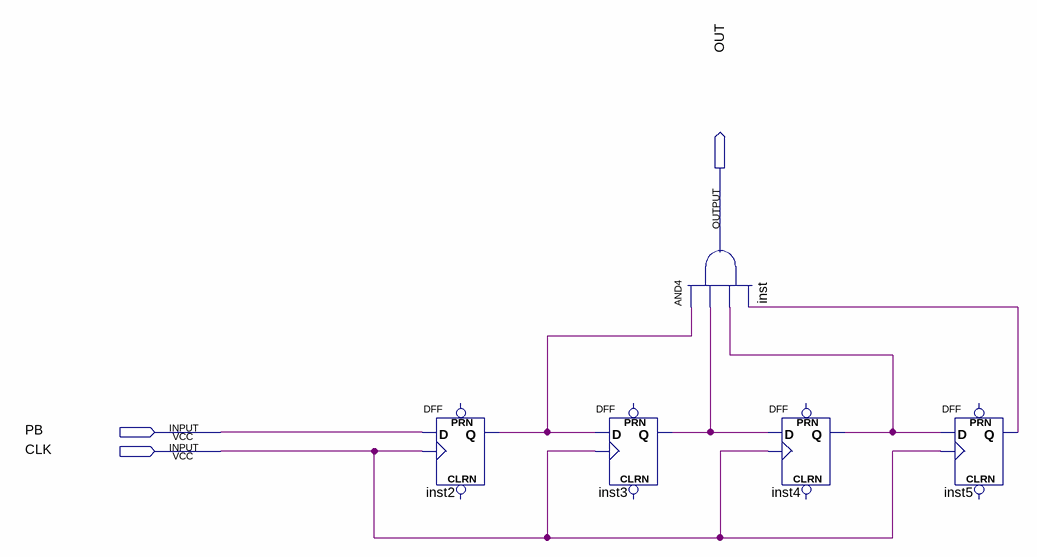
[diagram p0: schematic sheet]
// Quartus schematic debouncer.bdf as structural Verilog: 5 symbols, 3 pins
module debouncer (
  input  PB,
  input  CLK,
  output OUT
);

  wire inst2_q, inst3_q, inst4_q, inst5_q;

  DFF inst2 (.CLK(CLK), .D(PB), .Q(inst2_q));  // open: CLRN, PRN
  DFF inst3 (.CLK(CLK), .D(inst2_q), .Q(inst3_q));  // open: CLRN, PRN
  and inst (OUT, inst2_q, inst3_q, inst4_q, inst5_q);
  DFF inst4 (.CLK(CLK), .D(inst3_q), .Q(inst4_q));  // open: CLRN, PRN
  DFF inst5 (.CLK(CLK), .D(inst4_q), .Q(inst5_q));  // open: CLRN, PRN
endmodule
